# EAGLE schematic MaxBoard (EAGLE 7.6.0)
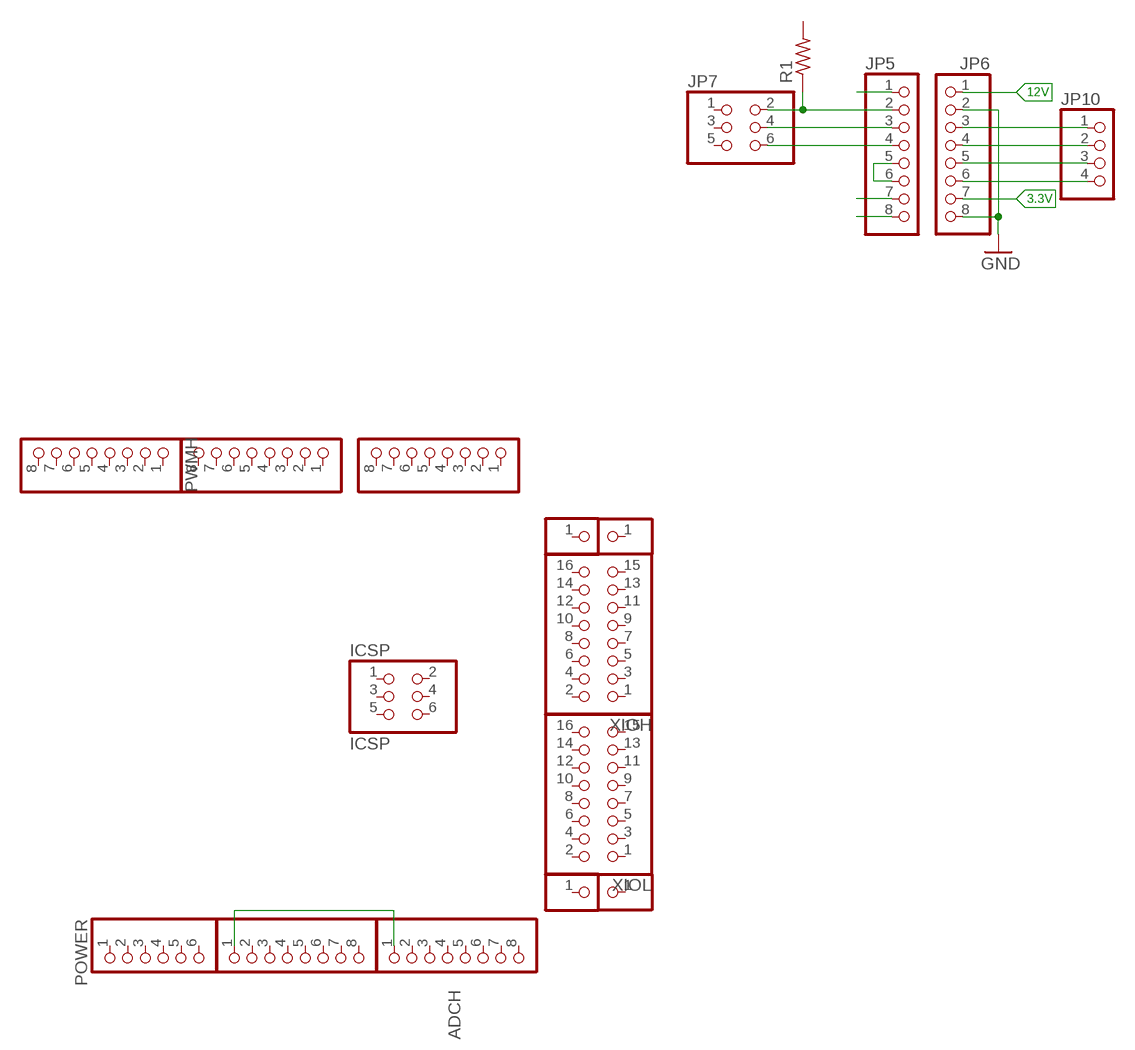
[diagram p0: schematic, sheet 1]

## Parts
ADCH  PINHD-1X8  [1X08]
ADCL  PINHD-1X8  [1X08]
COMMUNICATION  PINHD-1X8  [1X08]
ICSP  ICSP  PINHD-2X3  [2X03]
JP1  PINHD-1X1  [1X01]
JP2  PINHD-1X1  [1X01]
JP3  PINHD-1X1  [1X01]
JP4  PINHD-1X1  [1X01]
JP5  PINHD-1X8  [1X08]
JP6  PINHD-1X8  [1X08]
JP7  PINHD-2X3  [2X03]
JP10  PINHD-1X4  [1X04]
POWER  PINHD-1X6  [1X06]
PWMH  PINHD-1X8  [1X08]
PWML  PINHD-1X8  [1X08]
R1  R-US_0207/7  [0207/7]
XIOH  PINHD-2X8  [2X08]
XIOL  PINHD-2X8  [2X08]

## Nets
3.3V: JP6.7
12V: JP6.1
GND: JP6.2 JP6.8
N$1: ADCH.1 ADCL.1
N$2: JP5.2 JP7.2 R1.1
N$3: JP5.3 JP7.4
N$4: JP5.4 JP7.6
N$5: JP5.8
N$6: JP5.7
N$8: JP5.5 JP5.6
N$9: JP5.1
N$11: JP6.3 JP10.1
N$12: JP6.4 JP10.2
N$13: JP6.5 JP10.3
N$14: JP6.6 JP10.4
Unconnected: ADCH.2 ADCH.3 ADCH.4 ADCH.5 ADCH.6 ADCH.7 ADCH.8 ADCL.2 ADCL.3 ADCL.4 ADCL.5 ADCL.6 ADCL.7 ADCL.8 COMMUNICATION.1 COMMUNICATION.2 COMMUNICATION.3 COMMUNICATION.4 COMMUNICATION.5 COMMUNICATION.6 COMMUNICATION.7 COMMUNICATION.8 ICSP.1 ICSP.2 ICSP.3 ICSP.4 ICSP.5 ICSP.6 JP1.1 JP2.1 JP3.1 JP4.1 JP7.1 JP7.3 JP7.5 POWER.1 POWER.2 POWER.3 POWER.4 POWER.5 POWER.6 PWMH.1 PWMH.2 PWMH.3 PWMH.4 PWMH.5 PWMH.6 PWMH.7 PWMH.8 PWML.1 PWML.2 PWML.3 PWML.4 PWML.5 PWML.6 PWML.7 PWML.8 R1.2 XIOH.1 XIOH.2 XIOH.3 XIOH.4 XIOH.5 XIOH.6 XIOH.7 XIOH.8 XIOH.9 XIOH.10 XIOH.11 XIOH.12 XIOH.13 XIOH.14 XIOH.15 XIOH.16 XIOL.1 XIOL.2 XIOL.3 XIOL.4 XIOL.5 XIOL.6 XIOL.7 XIOL.8 XIOL.9 XIOL.10 XIOL.11 XIOL.12 XIOL.13 XIOL.14 XIOL.15 XIOL.16

## Library data of the parts
ADCH ADCL COMMUNICATION JP5 JP6 PWMH PWML = pinhead:PINHD-1X8: PIN HEADER
ICSP JP7 = pinhead:PINHD-2X3: PIN HEADER
JP1-JP4 = pinhead:PINHD-1X1: PIN HEADER
JP10 = pinhead:PINHD-1X4: PIN HEADER
POWER = pinhead:PINHD-1X6: PIN HEADER
R1 = rcl:R-US_: RESISTOR, American symbol
XIOH XIOL = pinhead:PINHD-2X8: PIN HEADER

## Net classes
0 default: width 0.15 mm, drill 0.3 mm, clearance 0.15 mm